# Altium schematic sheet puissance.SchDoc
size A3
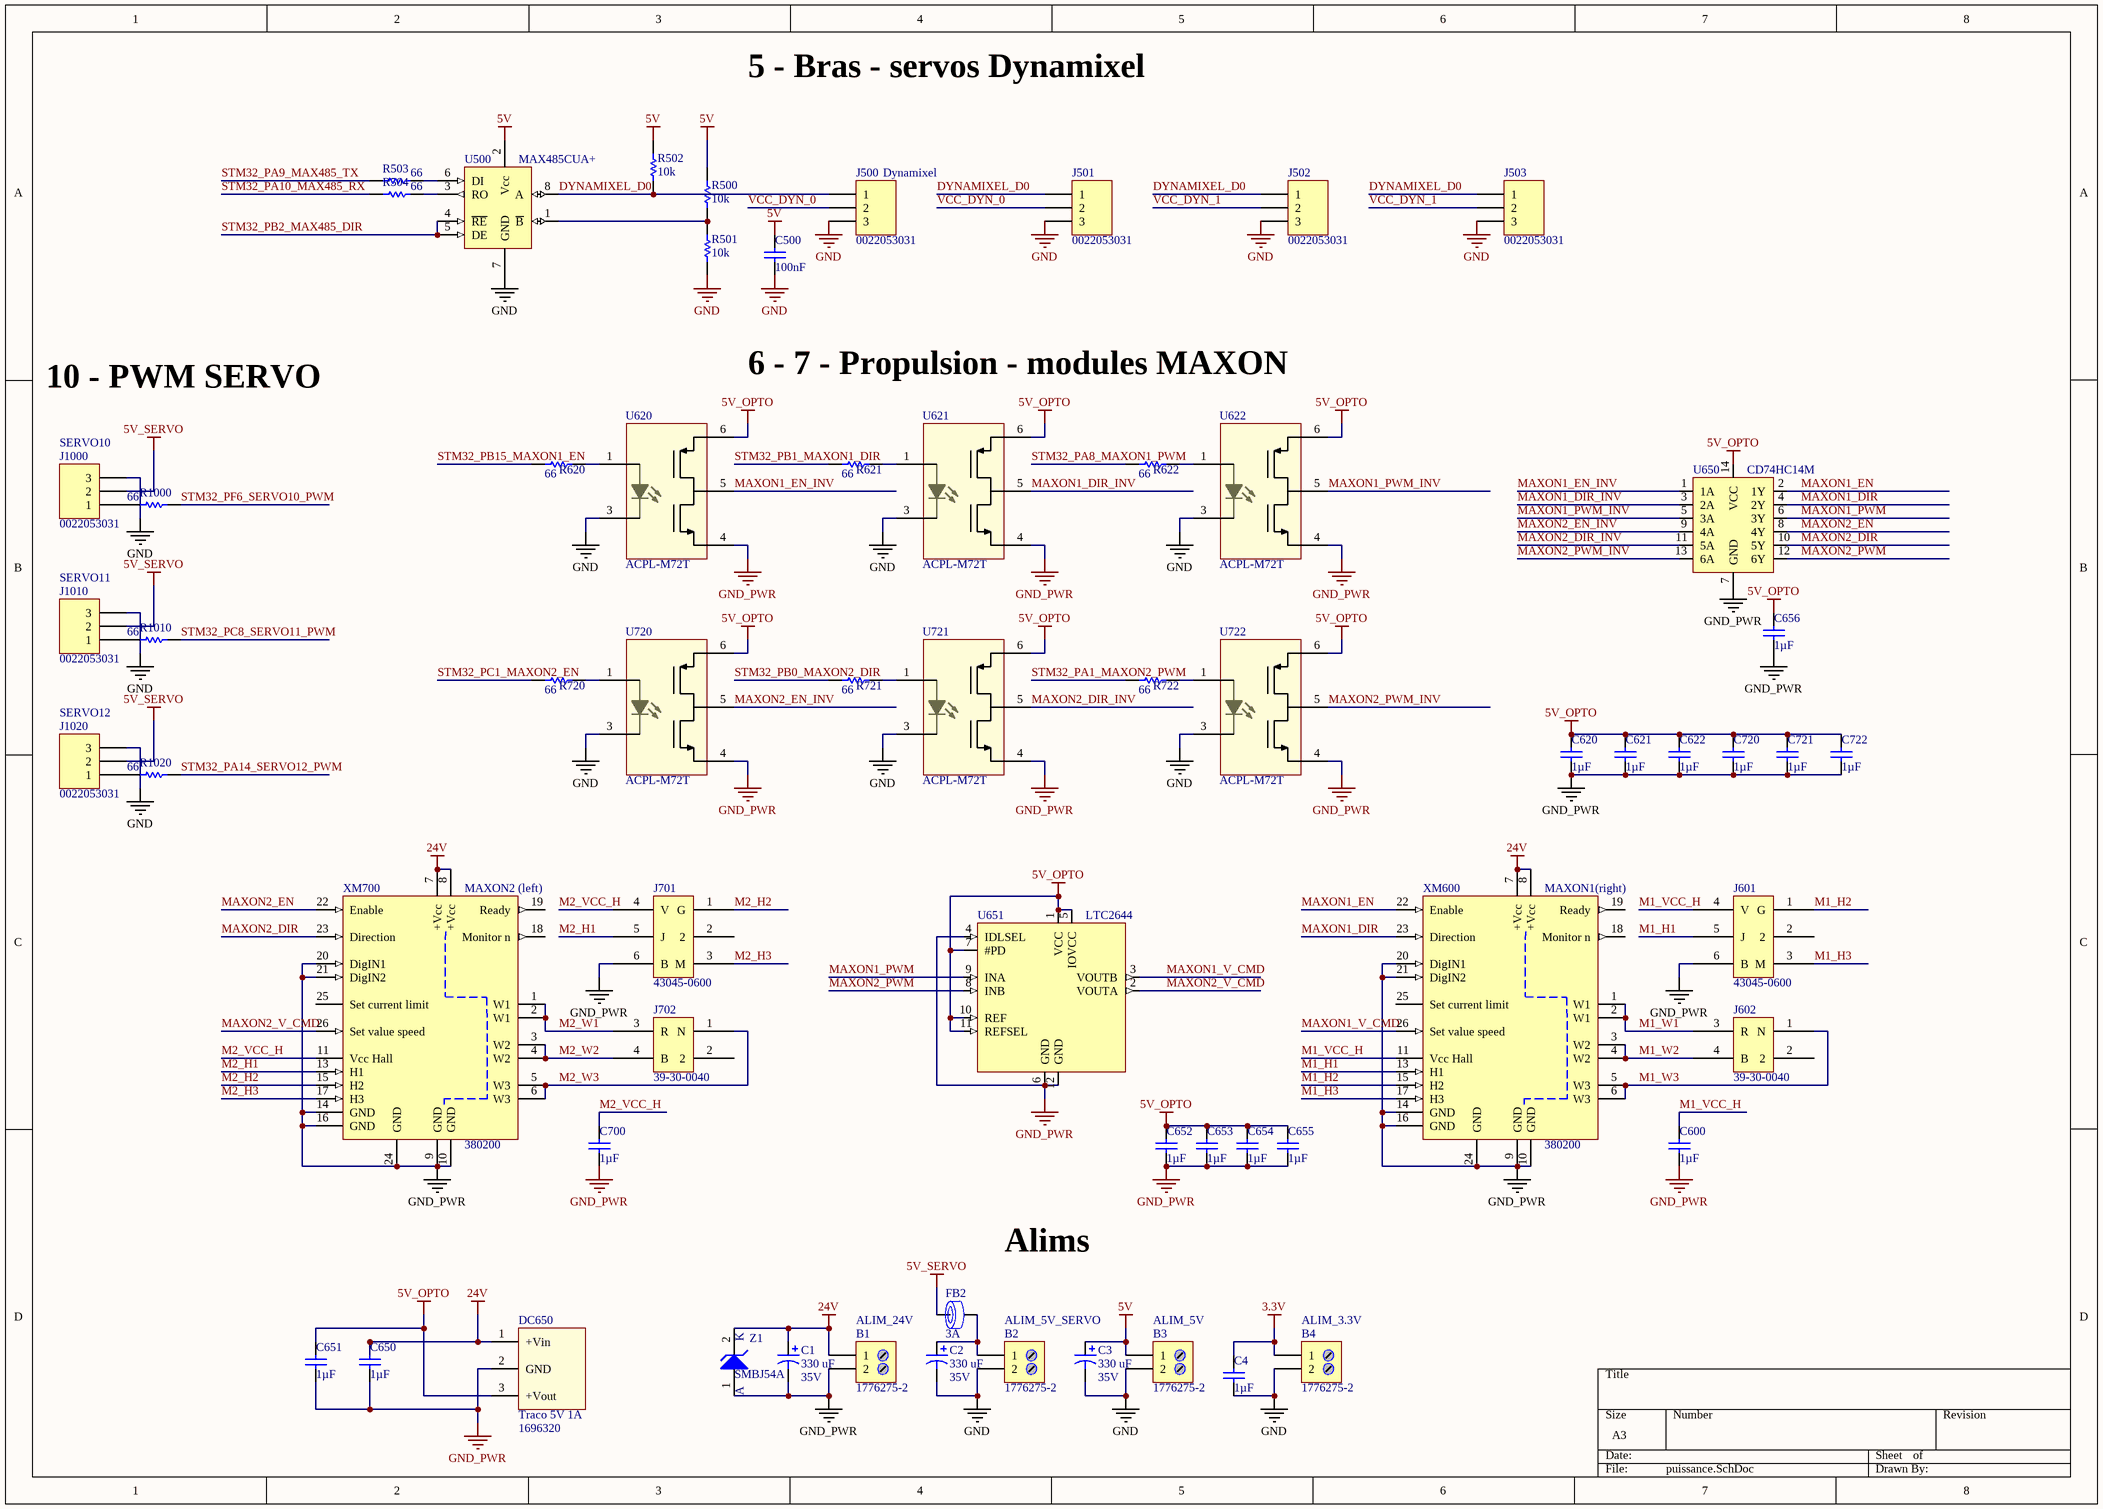
[diagram p0: puissance.SchDoc]

## Parts
B1  1776275-2  [BORNIER_2V_3.5MM]
B2  1776275-2  [BORNIER_2V_3.5MM]
B3  1776275-2  [BORNIER_2V_3.5MM]
B4  1776275-2  [BORNIER_2V_3.5MM]
C1  330 uF  RatedVoltage: 35V  [WCAP-ATG8_10x12.5x5x0.6]
C2  330 uF  RatedVoltage: 35V  [WCAP-ATG8_10x12.5x5x0.6]
C3  330 uF  RatedVoltage: 35V  [WCAP-ATG8_10x12.5x5x0.6]
C4  1µF  [C0805_N]
C500  100nF  [C0805_N]
C600  1µF  [C0805_N]
C620  1µF  [C0805_N]
C621  1µF  [C0805_N]
C622  1µF  [C0805_N]
C650  1µF  [C0805_N]
C651  1µF  [C0805_N]
C652  1µF  [C0805_N]
C653  1µF  [C0805_N]
C654  1µF  [C0805_N]
C655  1µF  [C0805_N]
C656  1µF  [C0805_N]
C700  1µF  [C0805_N]
C720  1µF  [C0805_N]
C721  1µF  [C0805_N]
C722  1µF  [C0805_N]
DC650  Traco 5V 1A  Supplier Part Number 1: 1696320  [TSR1]
FB2  RatedCurrent: 3A  [WE-CBF_0805_High Current]  (hidden comment: 742792023)
J500  0022053031  [HDR1X3]
J501  0022053031  [HDR1X3]
J502  0022053031  [HDR1X3]
J503  0022053031  [HDR1X3]
J601  43045-0600  [43045-0600]
J602  39-30-0040  [39-30-0040]
J701  43045-0600  [43045-0600]
J702  39-30-0040  [39-30-0040]
J1000  0022053031  [HDR1X3]
J1010  0022053031  [HDR1X3]
J1020  0022053031  [HDR1X3]
R500  10k  [R0805_N]
R501  10k  [R0805_N]
R502  10k  [R0805_N]
R503  66  [R0805_N]
R504  66  [R0805_N]
R620  66  [R0805_N]
R621  66  [R0805_N]
R622  66  [R0805_N]
R720  66  [R0805_N]
R721  66  [R0805_N]
R722  66  [R0805_N]
R1000  66  [R0805_N]
R1010  66  [R0805_N]
R1020  66  [R0805_N]
U500  MAX485CUA+  [MMAX-8]
U620  ACPL-M72T  [ACPL-M72T]
U621  ACPL-M72T  [ACPL-M72T]
U622  ACPL-M72T  [ACPL-M72T]
U650  CD74HC14M  [SOIC127P600X175-14N]
U651  LTC2644  [MSOP-12_LTC2644]
U720  ACPL-M72T  [ACPL-M72T]
U721  ACPL-M72T  [ACPL-M72T]
U722  ACPL-M72T  [ACPL-M72T]
XM600  380200  [380200]
XM700  380200  [380200]
Z1  SMBJ54A  [SMA Diode (DO-214AA)]

## Nets
3.3V: B4.1 C4.2
5V: B3.1 C3.1 C500.2 R500.2 R502.2 U500.2(Vcc)
5V_OPTO: C620.2 C621.2 C622.2 C651.2 C652.2 C653.2 C654.2 C655.2 C656.2 C720.2 C721.2 C722.2 DC650.3(+Vout) U620.6(VDD) U621.6(VDD) U622.6(VDD) U650.14(VCC) U651.1(VCC) U651.5(IOVCC) U651.7(#PD) U651.10(REF) U651.11(REFSEL) U720.6(VDD) U721.6(VDD) U722.6(VDD)
5V_SERVO: FB2.1 J1000.2 J1010.2 J1020.2
24V: B1.1 C1.1 C650.2 DC650.1(+Vin) XM600.7(+Vcc) XM600.8(+Vcc) XM700.7(+Vcc) XM700.8(+Vcc) Z1.2
GND: B2.2 B3.2 B4.2 C2.2 C3.2 C4.1 C500.1 J500.3 J501.3 J502.3 J503.3 J1000.3 J1010.3 J1020.3 R501.1 U500.7(GND) U620.3(Cathode) U621.3(Cathode) U622.3(Cathode) U720.3(Cathode) U721.3(Cathode) U722.3(Cathode)
GND_PWR: B1.2 C1.2 C600.1 C620.1 C621.1 C622.1 C650.1 C651.1 C652.1 C653.1 C654.1 C655.1 C656.1 C700.1 C720.1 C721.1 C722.1 DC650.2(GND) J601.6(B) J701.6(B) U620.4(GND) U621.4(GND) U622.4(GND) U650.7(GND) U651.4(IDLSEL) U651.6(GND) U651.12(GND) U720.4(GND) U721.4(GND) U722.4(GND) XM600.9(GND) XM600.10(GND) XM600.14(GND) XM600.16(GND) XM600.20(DigIN1) XM600.21(DigIN2) XM600.24(GND) XM700.9(GND) XM700.10(GND) XM700.14(GND) XM700.16(GND) XM700.20(DigIN1) XM700.21(DigIN2) XM700.24(GND) Z1.1
DYNAMIXEL_D0: J500.1 J501.1 J502.1 J503.1 R502.1 U500.8(A)
M1_H1: J601.5(J) XM600.13(H1)
M1_H2: J601.1(G) XM600.15(H2)
M1_H3: J601.3(M) XM600.17(H3)
M1_VCC_H: C600.2 J601.4(V) XM600.11(Vcc_Hall)
M1_W1: J602.3(R) XM600.1(W1) XM600.2(W1)
M1_W2: J602.4(B) XM600.3(W2) XM600.4(W2)
M1_W3: J602.1(N) XM600.5(W3) XM600.6(W3)
M2_H1: J701.5(J) XM700.13(H1)
M2_H2: J701.1(G) XM700.15(H2)
M2_H3: J701.3(M) XM700.17(H3)
M2_VCC_H: C700.2 J701.4(V) XM700.11(Vcc_Hall)
M2_W1: J702.3(R) XM700.1(W1) XM700.2(W1)
M2_W2: J702.4(B) XM700.3(W2) XM700.4(W2)
M2_W3: J702.1(N) XM700.5(W3) XM700.6(W3)
MAXON1_DIR: U650.4(2Y) XM600.23(Direction)
MAXON1_DIR_INV: U621.5(Vo) U650.3(2A)
MAXON1_EN: U650.2(1Y) XM600.22(Enable)
MAXON1_EN_INV: U620.5(Vo) U650.1(1A)
MAXON1_PWM: U650.6(3Y) U651.9(INA)
MAXON1_PWM_INV: U622.5(Vo) U650.5(3A)
MAXON1_V_CMD: U651.3(VOUTB) XM600.26(Set_value_speed)
MAXON2_DIR: U650.10(5Y) XM700.23(Direction)
MAXON2_DIR_INV: U650.11(5A) U721.5(Vo)
MAXON2_EN: U650.8(4Y) XM700.22(Enable)
MAXON2_EN_INV: U650.9(4A) U720.5(Vo)
MAXON2_PWM: U650.12(6Y) U651.8(INB)
MAXON2_PWM_INV: U650.13(6A) U722.5(Vo)
MAXON2_V_CMD: U651.2(VOUTA) XM700.26(Set_value_speed)
STM32_PA1_MAXON2_PWM: R722.1
STM32_PA8_MAXON1_PWM: R622.1
STM32_PA9_MAX485_TX: R503.2
STM32_PA10_MAX485_RX: R504.2
STM32_PA14_SERVO12_PWM: R1020.1
STM32_PB0_MAXON2_DIR: R721.1
STM32_PB1_MAXON1_DIR: R621.1
STM32_PB2_MAX485_DIR: U500.4(~{RE}) U500.5(DE)
STM32_PB15_MAXON1_EN: R620.1
STM32_PC1_MAXON2_EN: R720.1
STM32_PC8_SERVO11_PWM: R1010.1
STM32_PF6_SERVO10_PWM: R1000.1
VCC_DYN_0: J500.2 J501.2
VCC_DYN_1: J502.2 J503.2
NetB2_1: B2.1 C2.1 FB2.2
NetJ1000_1: J1000.1 R1000.2
NetJ1010_1: J1010.1 R1010.2
NetJ1020_1: J1020.1 R1020.2
NetR500_1: R500.1 R501.2 U500.1(~{B})
NetR503_1: R503.1 U500.6(DI)
NetR504_1: R504.1 U500.3(RO)
NetR620_2: R620.2 U620.1(Anode)
NetR621_2: R621.2 U621.1(Anode)
NetR622_2: R622.2 U622.1(Anode)
NetR720_2: R720.2 U720.1(Anode)
NetR721_2: R721.2 U721.1(Anode)
NetR722_2: R722.2 U722.1(Anode)

Not connected (* = marked no-connect by the designer): J601 2; J602 2; J701 2; J702 2; XM600 12(nc) 18(Monitor_n) 19(Ready) 25(Set_current_limit); XM700 12(nc) 18(Monitor_n) 19(Ready) 25(Set_current_limit)

## Notes on the sheet
- 5 - Bras - servos Dynamixel
- (near J500) Dynamixel
- 6 - 7 - Propulsion - modules MAXON
- 10 - PWM SERVO
- (near J1000) SERVO10
- (near J1010) SERVO11
- (near J1020) SERVO12
- (near XM700) MAXON2 (left)
- (near XM600) MAXON1(right)
- Alims
- ALIM_24V
- ALIM_5V_SERVO
- (near B3) ALIM_5V
- (near B4) ALIM_3.3V
- (in symbol SMBJ54A) K; A

## Library data of the parts
B1-B4 = 1776275-2: TERM BLOCK 2POS SIDE ENT 3.5MM; Manufacturer: TE Connectivity AMP Connectors; Supplier 1: Farnell; Supplier Part Number 1: 1098611; Manufacturer Part Number: 1776275-2; ComponentLink1URL: http://www.te.com/commerce/DocumentDelivery/DDEController?Action=srchrtrv&DocNm=1776275&DocType=Customer+Drawing&DocLang=English; ComponentLink1Description: http://www.te.com/commerce/DocumentDelivery/DDEController?Action=srchrtrv&DocNm=1776275&DocType=Customer+Drawing&DocLang=English
C1-C3 = WCAP-ATG8, 860010575012: CAP Alu 330 UF 20% 35 V; Manufacturer: Wurth Elektronik; PublishedDate: July 2016; ComponentLink1Description: Manufacturer; ComponentLink1URL: http://www.we-online.de; ComponentLink2Description: Datasheet; ComponentLink2URL: http://katalog.we-online.de/pbs/datasheet/860010575012.pdf; Manufacturer Part Number: 860010575012; Value: 330 uF; Size: 10mmx12.5mm
C4 C500 C600 C620-C622 C650-C656 C700 C720-C722 = Condensateur: Capacitor; Published: 8-Jun-2000; LatestRevisionDate: 17-Jul-2002; LatestRevisionNote: Re-released for DXP Platform.; PackageReference: RAD-0.3; Publisher: Altium Limited
  C4 C600 C620-C622 C650-C656 C700 C720-C722: Value: 1µF
  C500: Value: 100nF
DC650 = TSR1-24120: Traco 12.0V 12W 1A; Manufacturer: TRACOPOWER; Manufacturer Part Number: TSR1-2450; Pricing: 1=65.7, 5=63.73, 10=61.82, 25=59.97 (EUR); Supplier 1: Farnell
FB2 = WE-CBF, 742792023: Ferrite Bead 120ohm 0805 max3.0A; Manufacturer: Wurth Elektronik; Value: 120Ω; Type: High Current; PublishedDate: Aug 2016; ComponentLink1Description: Manufacturer; ComponentLink1URL: http://www.we-online.de; ComponentLink2Description: Datasheet; ComponentLink2URL: http://katalog.we-online.de/pbs/datasheet/742792023.pdf; Manufacturer Part Number: 742792023; Size: 0805
J500-J503 J1000 J1010 J1020 = 0022053031: CONN HEADER 3POS .100 R/A TIN; Manufacturer: Molex, LLC; Supplier 1: Farnell; Supplier Part Number 1: 1462932; Manufacturer Part Number: 0022053031; ComponentLink1URL: http://www.molex.com/pdm_docs/sd/022053031_sd.pdf; ComponentLink1Description: http://www.molex.com/pdm_docs/sd/022053031_sd.pdf
J601 J701 = 43045-0600: CONN HEADER 6POS 3MM RT ANG TIN; Manufacturer: MOLEX; Supplier 1: Farnell; Manufacturer Part Number: 43045-0600; ComponentLink1URL: http://www.farnell.com/datasheets/2216475.pdf; ComponentLink1Description: http://www.farnell.com/datasheets/2216475.pdf; Supplier Part Number 1: 1012252
J602 J702 = 39-30-0040: MOLEX  39-30-0040 4.2 mm, 4 Contact(s); Supplier 1: Farnell; Supplier Part Number 1: 1697133; Manufacturer: MOLEX; Manufacturer Part Number: 39-30-0040; ComponentLink1URL: http://www.farnell.com/datasheets/328793.pdf; ComponentLink1Description: http://www.farnell.com/datasheets/328793.pdf
R500-R502 = Resistor: Published: 8-Jun-2000; LatestRevisionDate: 17-Jul-2002; LatestRevisionNote: Re-released for DXP Platform.; PackageReference: AXIAL-0.5; Publisher: Altium Limited; Value: 10k
R503 R504 R620-R622 R720-R722 R1000 R1010 R1020 = Resistor: Value: 10k; Published: 8-Jun-2000; LatestRevisionDate: 17-Jul-2002; LatestRevisionNote: Re-released for DXP Platform.; PackageReference: AXIAL-0.5; Publisher: Altium Limited
U500 = MAX485CUA+: IC TXRX RS485/RS422 8-UMAX; Manufacturer: Maxim Integrated; Manufacturer Part Number: MAX485CUA+; ComponentLink1URL: http://datasheets.maximintegrated.com/en/ds/MAX1487-MAX491.pdf; ComponentLink1Description: http://datasheets.maximintegrated.com/en/ds/MAX1487-MAX491.pdf; Supplier 1: Farnell; Supplier Part Number 1: 2511735
U620-U622 U720-U722 = ACPL-M72T: Optocoupleur; Manufacturer: AVAGO TECHNOLOGIES; Supplier 1: Mouser; Manufacturer Part Number: ACPL-M72T
U650 = CD74HC14M: IC HEX INV SCHMITT TRIG 14-SOIC; Manufacturer: Texas Instruments; Supplier 1: Farnell; Supplier Part Number 1: 1103160; Manufacturer Part Number: CD74HC14M; ComponentLink1URL: http://www.ti.com/lit/ds/symlink/cd74hc14.pdf; ComponentLink1Description: http://www.ti.com/lit/ds/symlink/cd74hc14.pdf
XM600 XM700 = 380200: DEC Module 50/5, amplificateur EC 1 Q 50 V / 5 A, régulation de vitesse, module OEM; Manufacturer: Maxon Motor; Manufacturer Part Number: 380200; ComponentLink1URL: http://www.maxonmotor.fr/medias/sys_master/root/8816547528734/380200-Notice-dUtilisation-Fr.pdf; ComponentLink1Description: http://www.maxonmotor.fr/medias/sys_master/root/8816547528734/380200-Notice-dUtilisation-Fr.pdf
Z1 = SMBJ54A: DIODE TVS (Transil unidirectionelle); Manufacturer: ON Semiconductor; Value: 54V; Supplier 1: Farnell; Manufacturer Part Number: SMBJ54A; ComponentLink1URL: http://www.fairchildsemi.com/datasheets/SM/SMBJ54A.pdf; ComponentLink1Description: http://www.fairchildsemi.com/datasheets/SM/SMBJ54A.pdf; Supplier part number 1: 1700734
U651 = LTC2644: Manufacturer Part Number: LTC2644